# Altium schematic sheet 07-1G Phy1.SchDoc
size B; SheetNumber: 7; SheetTotal: 25; SPICEModelCacheWFXGVWAF: <root> / <DocumentId>WFXGVWAF</DocumentId> / <CacheFrame Number="0"> / <Model Name="emk105bj105_v-f" Kind="CKT"> / <Text>* EMK105BJ105_V-F     SPICE MODEL  ( General Type ) / *-------------------------------------------------------------------------------------------------------- / * Model Generated by TAIYO YUDEN Corporation (http://www.ty-top.com) / * Version 1.0 / * TAIYO YUDEN Control No. 170508_130520 / * Copyright(c) 2012 TAIYO YUDEN CO.,LTD. All Rights Reserved. / *-------------------------------------------------------------------------------------------------------- / * / * Products Name : Multilayer Ceramic Capacitors / * / * Characteristics : / *     Capacitance : 1 uF , Rated Voltage : 16V , TCC : X5R / *     Case Size : 1.0 x 0.5 / 0.039 x 0.02 [mm/inch] , Thickness : 0.5 / 0.02 [mm/inch] / *     (Conditions: Temperature = 25 degC , DC Bias Current/Voltage = 0A / 0V) / * / * Frequency Range : 40Hz - 3GHz / * / * External Node Assignments : / * / *  1  o---| |---o  2 / * / *-------------------------------------------------------------------------------------------------------- / .SubCkt EMK105BJ105_V-F 1 2 / **************************** / C0 1 110 0.68309u / Cm 1 101 0.26053u / C1 101 102 0.94076u / Rc1 101 102 1.9029k / C2 102 103 0.66707u / Rc2 102 103 120.36 / C3 103 110 0.57203u / Rc3 103 110 2.1097 / C2m 1 301 0.1871u / C21 301 302 3.2494u / Rc21 301 302 1.1117k / C22 302 303 2.1014u / Rc22 302 303 1.484k / C23 303 304 2.1172u / Rc23 303 304 1.3876k / C24 304 305 0.75729u / Rc24 304 305 332.59 / C25 305 306 0.94401u / Rc25 305 306 249.09 / C26 306 307 0.34674u / Rc26 306 307 28.352 / C27 307 308 0.37158u / Rc27 307 308 19.989 / C28 308 309 0.17933u / Rc28 308 309 31.748 / C29 309 110 0.016445u / Rc29 309 110 1.0592 / Rp0 1 110 100Meg / L0 110 120 0.2216n / Lm 120 130 0.1509n / L1 120 121 0.12659n / RL1 121 130 0.85161 / L2 120 122 0.15996n / RL2 122 130 0.42469 / L3 120 123 7.9543n / RL3 123 130 0.54643m / CR 120 124 0.24334u / LR 124 125 0.090738n / RR 125 130 68.076m / CL 130 140 2.7354p / LL 130 140 0.10762n / RL 130 140 50.614 / Rs 140 2 7.5416m / **************************** / .ends EMK105BJ105_V-F</Text> / </Model> / </CacheFrame> / </root>
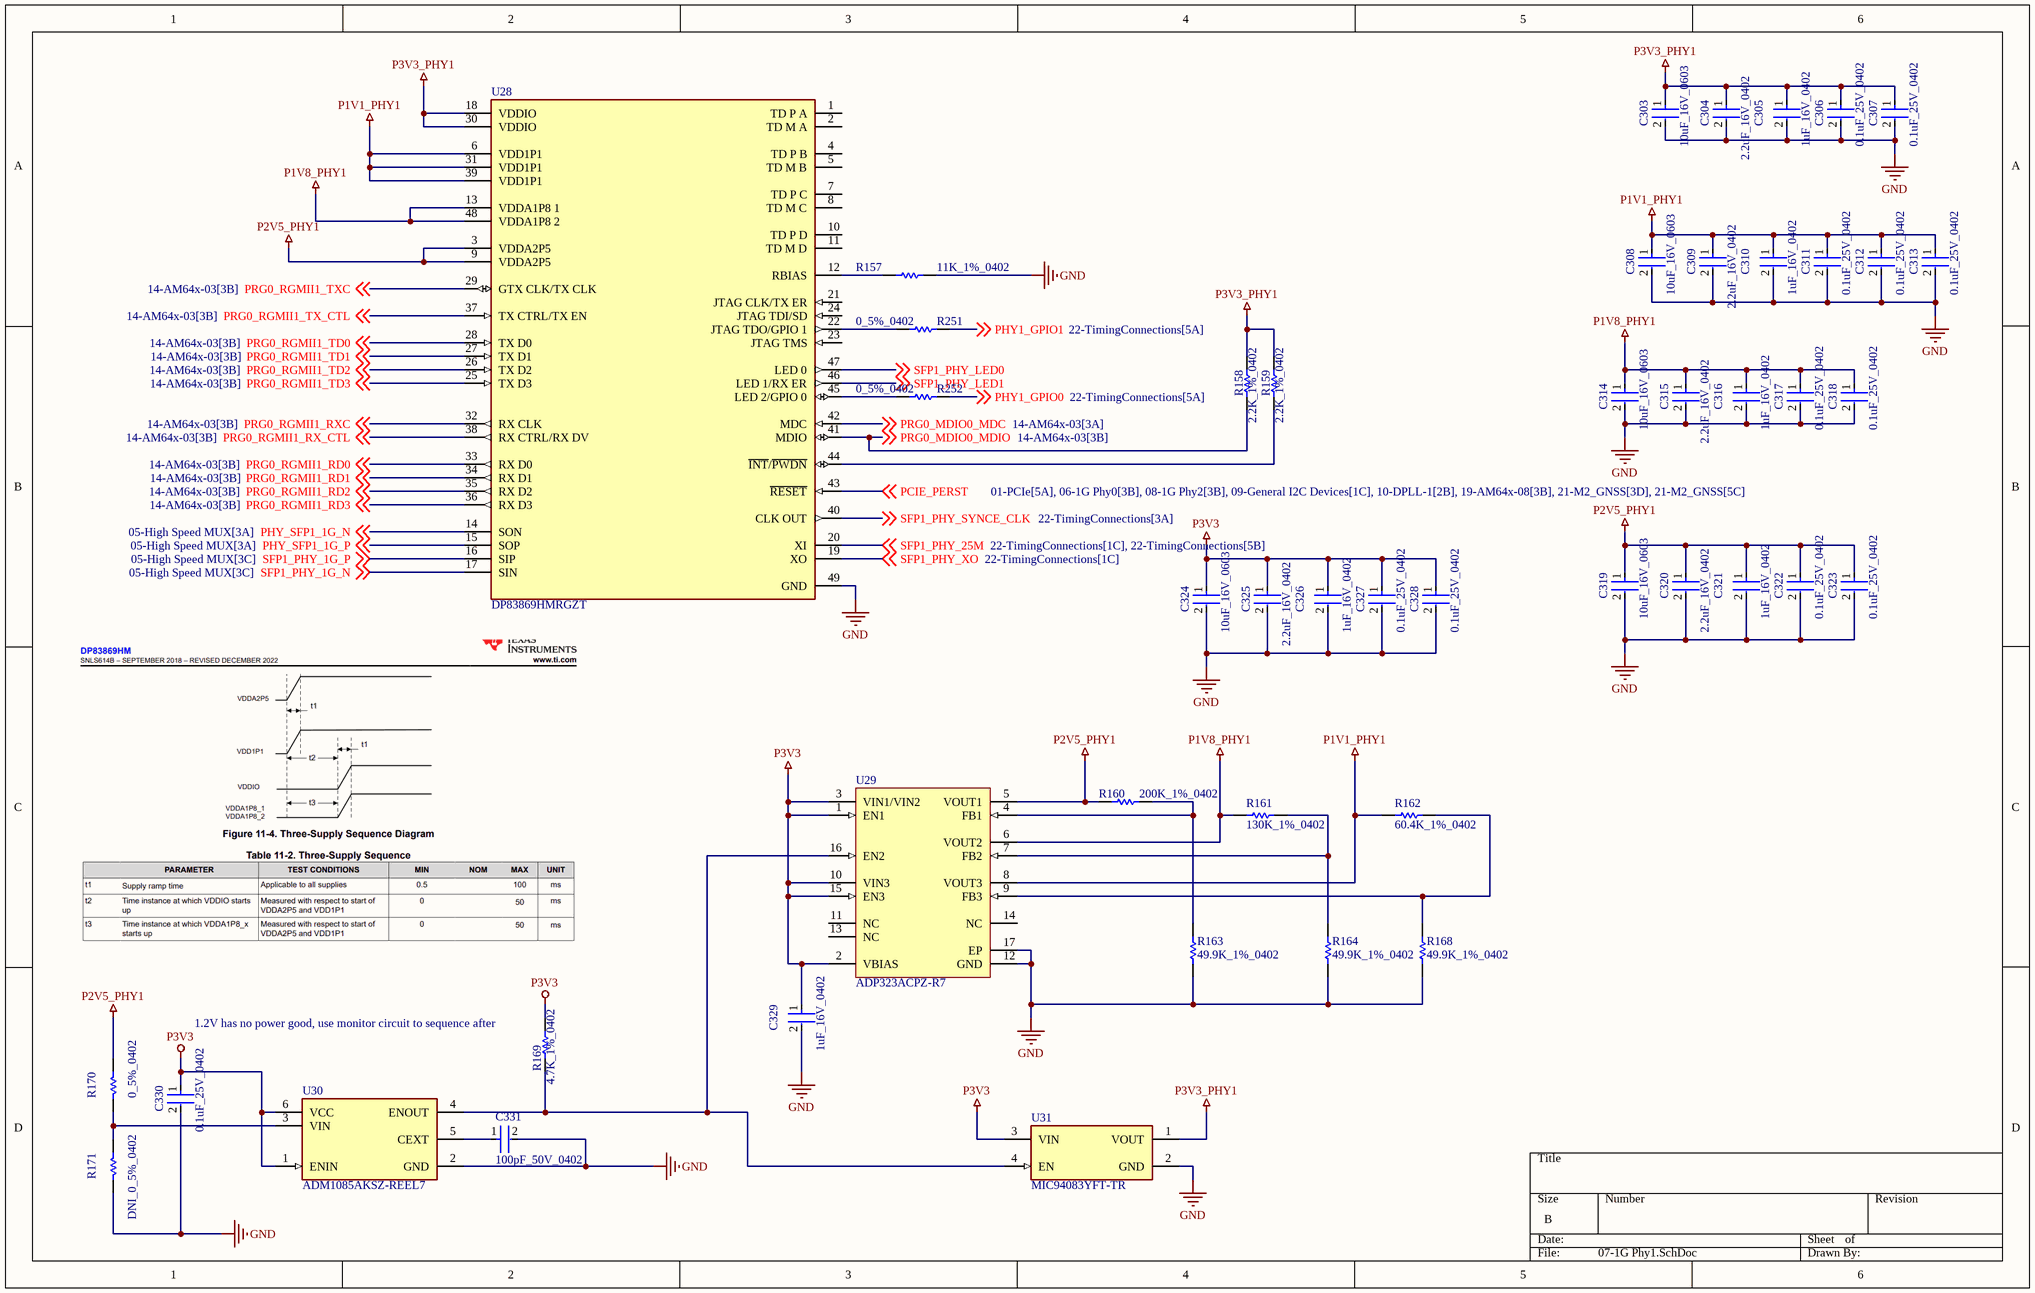
[diagram p0: 07-1G Phy1.SchDoc]

## Parts
C303  10uF_16V_0603  [FP-0603-L_1_6_0_2-W_0_8_0-MFG]
C304  2.2uF_16V_0402  [FP-C1005-050-0_05-IPC_A]
C305  1uF_16V_0402  [FP-0402-L_1_0_0_05-W_0_5-IPC_A]
C306  0.1uF_25V_0402  [FP-0402-L_1_0_1-W_0_5_0_1-IPC_C]
C307  0.1uF_25V_0402  [FP-0402-L_1_0_1-W_0_5_0_1-IPC_C]
C308  10uF_16V_0603  [FP-0603-L_1_6_0_2-W_0_8_0-MFG]
C309  2.2uF_16V_0402  [FP-C1005-050-0_05-IPC_A]
C310  1uF_16V_0402  [FP-0402-L_1_0_0_05-W_0_5-IPC_A]
C311  0.1uF_25V_0402  [FP-0402-L_1_0_1-W_0_5_0_1-IPC_C]
C312  0.1uF_25V_0402  [FP-0402-L_1_0_1-W_0_5_0_1-IPC_C]
C313  0.1uF_25V_0402  [FP-0402-L_1_0_1-W_0_5_0_1-IPC_C]
C314  10uF_16V_0603  [FP-0603-L_1_6_0_2-W_0_8_0-MFG]
C315  2.2uF_16V_0402  [FP-C1005-050-0_05-IPC_A]
C316  1uF_16V_0402  [FP-0402-L_1_0_0_05-W_0_5-IPC_A]
C317  0.1uF_25V_0402  [FP-0402-L_1_0_1-W_0_5_0_1-IPC_C]
C318  0.1uF_25V_0402  [FP-0402-L_1_0_1-W_0_5_0_1-IPC_C]
C319  10uF_16V_0603  [FP-0603-L_1_6_0_2-W_0_8_0-MFG]
C320  2.2uF_16V_0402  [FP-C1005-050-0_05-IPC_A]
C321  1uF_16V_0402  [FP-0402-L_1_0_0_05-W_0_5-IPC_A]
C322  0.1uF_25V_0402  [FP-0402-L_1_0_1-W_0_5_0_1-IPC_C]
C323  0.1uF_25V_0402  [FP-0402-L_1_0_1-W_0_5_0_1-IPC_C]
C324  10uF_16V_0603  [FP-0603-L_1_6_0_2-W_0_8_0-MFG]
C325  2.2uF_16V_0402  [FP-C1005-050-0_05-IPC_A]
C326  1uF_16V_0402  [FP-0402-L_1_0_0_05-W_0_5-IPC_A]
C327  0.1uF_25V_0402  [FP-0402-L_1_0_1-W_0_5_0_1-IPC_C]
C328  0.1uF_25V_0402  [FP-0402-L_1_0_1-W_0_5_0_1-IPC_C]
C329  1uF_16V_0402  [FP-0402-L_1_0_0_05-W_0_5-IPC_A]
C330  0.1uF_25V_0402  [FP-0402-L_1_0_1-W_0_5_0_1-IPC_C]
C331  100pF_50V_0402  [FP-C0402-BB-MFG]
R157  11K_1%_0402  [RESC1005X40X25LL05T10]
R158  2.2K_1%_0402  [RESC1005X40X25ML10T10]
R159  2.2K_1%_0402  [RESC1005X40X25ML10T10]
R160  200K_1%_0402  [RESC1005X40X25LL10T10]
R161  130K_1%_0402  [RESC1005X40X25NL10T10]
R162  60.4K_1%_0402  [RESC1005X40X25LL05T10]
R163  49.9K_1%_0402  [RESC1005X40X25LL10T10]
R164  49.9K_1%_0402  [RESC1005X40X25LL10T10]
R168  49.9K_1%_0402  [RESC1005X40X25LL10T10]
R169  4.7K_1%_0402  [RESC1005X40X25NL10T10]
R170  0_5%_0402  [RESC1005X40X25LL10T10]
R171  DNI_0_5%_0402  [RESC1005X40X25LL10T10]  (no BOM)
R251  0_5%_0402  [RESC1005X40X25LL10T10]
R252  0_5%_0402  [RESC1005X40X25LL10T10]
U28  DP83869HMRGZT  [FP-RGZ0048B-IPC_A]
U29  ADP323ACPZ-R7  [ADI-CP-16-27_N]
U30  ADM1085AKSZ-REEL7  [FP-KS-6-IPC_B]
U31  MIC94083YFT-TR  [FP-FTDFN085085-4LD-PL-1-MFG]

## Nets
GND: C303.2 C304.2 C305.2 C306.2 C307.2 C308.2 C309.2 C310.2 C311.2 C312.2 C313.2 C314.2 C315.2 C316.2 C317.2 C318.2 C319.2 C320.2 C321.2 C322.2 C323.2 C324.2 C325.2 C326.2 C327.2 C328.2 C329.2 C330.2 C331.2 R157.2 R163.1 R164.1 R168.1 R171.2 U28.49(GND) U29.12(GND) U29.17(EP) U30.2(GND) U31.2(GND)
P1V1_PHY1: C308.1 C309.1 C310.1 C311.1 C312.1 C313.1 R162.1 U28.6(VDD1P1) U28.31(VDD1P1) U28.39(VDD1P1) U29.8(VOUT3)
P1V8_PHY1: C314.1 C315.1 C316.1 C317.1 C318.1 R161.1 U28.13(VDDA1P8_1) U28.48(VDDA1P8_2) U29.6(VOUT2)
P2V5_PHY1: C319.1 C320.1 C321.1 C322.1 C323.1 R160.1 R170.1 U28.3(VDDA2P5) U28.9(VDDA2P5) U29.5(VOUT1)
P3V3: C324.1 C325.1 C326.1 C327.1 C328.1 C329.1 C330.1 R169.1 U29.1(EN1) U29.2(VBIAS) U29.3(VIN1/VIN2) U29.10(VIN3) U29.15(EN3) U30.1(ENIN) U30.6(VCC) U31.3(VIN)
P3V3_PHY1: C303.1 C304.1 C305.1 C306.1 C307.1 R158.2 R159.2 U28.18(VDDIO) U28.30(VDDIO) U31.1(VOUT)
PCIE_PERST: U28.43(~{RESET}) ; off-sheet PCIE_PERST
PHY1_GPIO0: R252.2 ; off-sheet PHY1_GPIO0
PHY1_GPIO1: R251.2 ; off-sheet PHY1_GPIO1
PHY_SFP1_1G_N: U28.14(SON) ; off-sheet PHY_SFP1_1G_N
PHY_SFP1_1G_P: U28.15(SOP) ; off-sheet PHY_SFP1_1G_P
PRG0_MDIO0_MDC: U28.42(MDC) ; off-sheet PRG0_MDIO0_MDC
PRG0_MDIO0_MDIO: R158.1 U28.41(MDIO) ; off-sheet PRG0_MDIO0_MDIO
PRG0_RGMII1_RD0: U28.33(RX_D0) ; off-sheet PRG0_RGMII1_RD0
PRG0_RGMII1_RD1: U28.34(RX_D1) ; off-sheet PRG0_RGMII1_RD1
PRG0_RGMII1_RD2: U28.35(RX_D2) ; off-sheet PRG0_RGMII1_RD2
PRG0_RGMII1_RD3: U28.36(RX_D3) ; off-sheet PRG0_RGMII1_RD3
PRG0_RGMII1_RX_CTL: U28.38(RX_CTRL/RX_DV) ; off-sheet PRG0_RGMII1_RX_CTL
PRG0_RGMII1_RXC: U28.32(RX_CLK) ; off-sheet PRG0_RGMII1_RXC
PRG0_RGMII1_TD0: U28.28(TX_D0) ; off-sheet PRG0_RGMII1_TD0
PRG0_RGMII1_TD1: U28.27(TX_D1) ; off-sheet PRG0_RGMII1_TD1
PRG0_RGMII1_TD2: U28.26(TX_D2) ; off-sheet PRG0_RGMII1_TD2
PRG0_RGMII1_TD3: U28.25(TX_D3) ; off-sheet PRG0_RGMII1_TD3
PRG0_RGMII1_TX_CTL: U28.37(TX_CTRL/TX_EN) ; off-sheet PRG0_RGMII1_TX_CTL
PRG0_RGMII1_TXC: U28.29(GTX_CLK/TX_CLK) ; off-sheet PRG0_RGMII1_TXC
SFP1_PHY_1G_N: U28.17(SIN) ; off-sheet SFP1_PHY_1G_N
SFP1_PHY_1G_P: U28.16(SIP) ; off-sheet SFP1_PHY_1G_P
SFP1_PHY_25M: U28.20(XI) ; off-sheet SFP1_PHY_25M
SFP1_PHY_LED0: U28.47(LED_0) ; off-sheet SFP1_PHY_LED0
SFP1_PHY_LED1: U28.46(LED_1/RX_ER) ; off-sheet SFP1_PHY_LED1
SFP1_PHY_SYNCE_CLK: U28.40(CLK_OUT) ; off-sheet SFP1_PHY_SYNCE_CLK
SFP1_PHY_XO: U28.19(XO) ; off-sheet SFP1_PHY_XO
NetC331_1: C331.1 U30.5(CEXT)
NetR157_1: R157.1 U28.12(RBIAS)
NetR159_1: R159.1 U28.44(~{INT}/~{PWDN})
NetR160_2: R160.2 R163.2 U29.4(FB1)
NetR161_2: R161.2 R164.2 U29.7(FB2)
NetR162_2: R162.2 R168.2 U29.9(FB3)
NetR169_2: R169.2 U29.16(EN2) U30.4(ENOUT) U31.4(EN)
NetR170_2: R170.2 R171.1 U30.3(VIN)
NetR251_1: R251.1 U28.22(JTAG_TDO/GPIO_1)
NetR252_1: R252.1 U28.45(LED_2/GPIO_0)

Not connected (* = marked no-connect by the designer): U28 1(TD_P_A) 2(TD_M_A) 4(TD_P_B) 5(TD_M_B) 7(TD_P_C) 8(TD_M_C) 10(TD_P_D) 11(TD_M_D) 21(JTAG_CLK/TX_ER) 23(JTAG_TMS) 24(JTAG_TDI/SD); U29 11(NC) 13(NC) 14(NC)

## Notes on the sheet
- (near R169) 1.2V has no power good, use monitor circuit to sequence after

## Library data of the parts
C303 C308 C314 C319 C324 = CMP-2000-06226-4: Multilayer Ceramic Capacitor 10uF 16V X5R 20% SMD 0603 T/R; Packaging: Tape and Reel; Construction: Flat; Height: 0.8mm; Max Operating Temperature: 85°C; Dielectric: X5R; Case Code (Metric): 1608; Voltage Rating (DC): 16V; Width: 0.031inch; Voltage Rating: 16V; Length: 0.063inch; RoHS Compliant: Yes; Halogen Free: Halogen Free; Case Code (Imperial): 0603; Capacitance: 10uF; Mount: Surface Mount; Thickness: 0.031inch; Tolerance: 20%; Min Operating Temperature: -55°C; Series: M; Termination: SMD/SMT; Case/Package: 0603; Package Quantity: 1
C304 C309 C315 C320 C325 = CMP-2000-05998-2: Multilayer Ceramic Capacitors 2.2μF ±10% 16V X5R SMD 0402; Capacitance: 2.2uF; REACH SVHC: No SVHC; Series: C; Termination: SMD/SMT; Case Code (Imperial): 0402; Depth: 0.5mm; Mount: Surface Mount; Width: 0.02inch; Package Quantity: 1; Dielectric Material: Ceramic; Length: 1mm; Packaging: Tape and Reel; Case Code (Metric): 1005; RoHS Compliant: Yes; Dielectric: X5R; Max Operating Temperature: 85°C; Lead Free: Lead Free; Weight: 2.3E-05oz; Thickness: 0.022inch; Voltage Rating (DC): 16V; Tolerance: 10%; Voltage Rating: 16V; Resistor Type: Ceramic; Height: 0.5mm; Case/Package: 0402; Min Operating Temperature: -55°C
C305 C310 C316 C321 C326 C329 = CMP-14477-000104-2: None; Tolerance: 10%; Voltage Rating: 16V; Dielectric: X5R; Capacitance: 1uF; Packaging: Tape and Reel; Depth: 0.5mm; Mount: Surface Mount; Thickness: 0.022inch; Package Quantity: 1; Min Operating Temperature: -55°C; Series: M; Voltage Rating (DC): 16V; Termination: SMD/SMT; Case/Package: 0402; Number of Pins: 2; Case Code (Imperial): 0402; Length: 1mm; Halogen Free: Halogen Free; Case Code (Metric): 1005; Width: 0.02inch; RoHS Compliant: Yes; Radiation Hardening: No; Max Operating Temperature: 85°C; Height: 0.5mm; Construction: Flat
C306 C307 C311-C313 C317 C318 C322 C323 C327 C328 C330 = CMP-2008-02519-2: General Purpose Ceramic Capacitor, 0402, 100nF, 10%, X7R, 15%, 25V; Package Quantity: 1; Capacitance: 100nF; Min Operating Temperature: -55°C; Voltage: 25V; Voltage Rating: 25V; Construction: Flat; Max Operating Temperature: 125°C; Radiation Hardening: No; Depth: 0.5mm; Thickness: 0.022inch; Voltage Rating (DC): 25V; Number of Pins: 2; Lead Free: Lead Free; Series: -; REACH SVHC: No SVHC; Length: 1mm; Dielectric: X7R; RoHS Compliant: Yes; Mount: Surface Mount; Packaging: Tape and Reel; Case/Package: 0402; Case Code (Imperial): 0402; Termination: SMD/SMT; Width: 0.02inch; Case Code (Metric): 1005; Tolerance: 10%
C331 = CMP-2008-03417-2: CAP CER 100PF 50V C0G/NP0 0402; Manufacturer: Kemet; Manufacturer Part Number: C0402C101G5GACTU; Material: Ceramic; Temperature Characteristic: C0G; Tolerance: 0.02; Temperature Coefficient: 15%; Temperature Range High: +125°C; Lead Free: Yes; Capacitance: 100 pF; Value: 100 pF; ComponentLink2URL: https://content.kemet.com/datasheets/KEM_C1002_X7R_SMD.pdf; Automotive: No; Voltage Rating: 50 V; Category: Cap; Device Class L2: Capacitors; ComponentLink2Description: Datasheet; Mouser Description: Multilayer Ceramic Capacitors MLCC - SMD/SMT 50volts 100pF C0G 2%; RoHS: TRUE; Device Class L3: Ceramic Capacitors; Temperature Range Low: -55°C; Octopart: https://octopart.com/c0402c101g5gactu-kemet-16782744; Height: 0.55mm; Ipc Land Pattern Name: CAPC10050X50; Package: C0402-BB; Device Class L1: Passive Components; Temperature: -55°C to +125°C; Digikey Description: CAP CER 100PF 50V C0G/NP0 0402
R157 = CMP-2002-07365-1: Manufacturer: Yageo / Phycomp; Part Number: RC0402FR-0711KL
R158 R159 = CMP-2002-06097-1: Part Number: MC00625W040212K2; Manufacturer: Multicomp
R160 = CMP-2002-04904-1: Part Number: CR0402-FX-2003GLF; Manufacturer: Bourns
R161 = CMP-2002-05688-1: Part Number: CRG0402F130K; Manufacturer: TE Connectivity / AMP
R162 = CMP-2002-07763-1: Manufacturer: Yageo / Phycomp; Part Number: RC0402FR-0760K4L
R163 R164 R168 = CMP-1011-00702-2: Manufacturer: Bourns; Part Number: CR0402-FX-4992GLF
R169 = CMP-2002-05217-1: Manufacturer: Bourns; Part Number: CR0402-FX-4701GLF
R170 R171 R251 R252 = CMP-2002-04569-1: Manufacturer: KOA Speer; Part Number: RK73Z1ETTP
U28 = CMP-04874-000002-2: IC TRANSCEIVER 1/1 48FN; RoHS Compliant: Yes
U29 = CMP-0786-00062-1: Triple, 200 mA, Low Noise, High PSRR Voltage Regulator, 2.5 to 5.5 V Vin, Adjustable Vout, Industrial, 16-pin QFN (CP-16-27), Reel; Manufacturer: Analog Devices; Vout Adjustable Range: 0.5V to 5V; Iout max: 200mA; Vin (max) (V): 5.5; Supply Current IGND @ Small Load: 85uA; Vin (min) (V): 2.5; ComponentLink2URL: http://www.analog.com/static/imported-files/data_sheets/ADP322_323.pdf; Code_JEDEC: MO-229; Mounting Technology: Surface Mount; DatasheetVersion: Rev. A; PartNumber: ADP323ACPZ-R7; ComponentLink3URL: http://www.analog.com/static/imported-files/packages/PKG_PDF/LFCSP(CP)/CP_16_27.pdf; ComponentLink4Description: URL Link1; PackageVersion: 091609-A, 09/2009; ComponentLink1Description: Manufacturer URL; ComponentLink3Description: Package Specification; Packing: Reel; PackageReference: CP-16-27; ComponentLink4URL: Product URL:http://www.analog.com/en/ADP323/productSearch.html; ComponentLink1URL: http://www.analog.com/en/index.html; PackageDescription: 16-Pin Lead Frame Chip Scale Package, Body 3 x 3 mm, Pitch 0.5 mm; ComponentLink2Description: Datasheet
U30 = CMP-09140-000008-1: IC SUPERVISOR 1 CHANNEL SC70-6; Min Reset Threshold Voltage: 560mV; Operating Supply Voltage: 125V; Operating Supply Current: 10uA; Reset: Active High; Max Reset Threshold Voltage: 640mV; Watchdog Timer: No; Min Supply Voltage: 2.25V; Number of Voltages Monitored: 1; Max Supply Current: 15uA; Threshold Voltage: 600mV; Max Supply Voltage: 3.6V; Nominal Supply Current: 10uA; Mount: Surface Mount; Width: 1.35mm; Max Operating Temperature: 125°C; Lead Free: Contains Lead; Package Quantity: 3000; Undervoltage Threshold: 560mV; Type: Sequencer; Packaging: Tape and Reel; Min Operating Temperature: -40°C; Radiation Hardening: No; REACH SVHC: No SVHC; Overvoltage Threshold: 640mV; Number of Pins: 6; Case/Package: SC; Length: 2.2mm; Height: 1mm; Number of Monitored Inputs: 1
U31 = CMP-06317-000053-1: IC PWR SWITCH P-CHAN 1:1 4TMLF; Turn-On Delay Time: 1.5us; Turn-Off Delay Time: 200ns; On-State Resistance: 67mR; Output Current: 2A; Min Supply Voltage: 1.7V; Number of Outputs: 1; Interface: On/Off; Output Configuration: High Side; Max Supply Voltage: 5.5V; Radiation Hardening: No; Min Operating Temperature: -40°C; Mount: Surface Mount; Series: -; RoHS Compliant: Yes; Number of Pins: 4; Reach SVHC Compliant: Yes; On-state Resistance-Max: 67MR; Package Quantity: 5000; Packaging: Tape and Reel; Max Output Current: 2A; Supply Current: 2A; Lead Free: Lead Free; Current Rating: 2A; Max Operating Temperature: 125°C; Rated Current-Max: 2A; Nominal Supply Current: 2A